# Altium schematic sheet LED_DEMUX.SchDoc
size A4; SheetNumber: 5; SheetTotal: 6
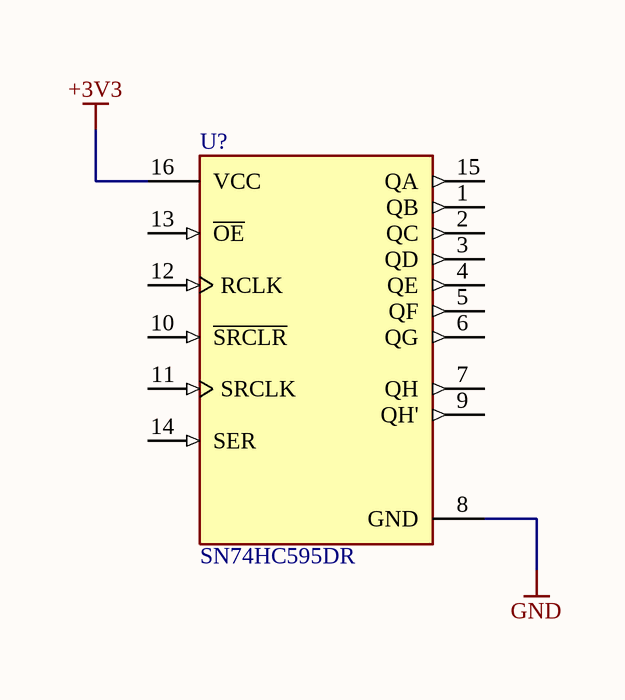
[diagram p0: LED_DEMUX.SchDoc]

## Parts
U?  SN74HC595DR  [FP-D0016A-MFG]

## Nets
+3V3: U?.16(VCC)
GND: U?.8(GND)

Not connected (* = marked no-connect by the designer): U? 1(QB) 2(QC) 3(QD) 4(QE) 5(QF) 6(QG) 7(QH) 9(QH') 10(~{SRCLR}) 11(SRCLK) 12(RCLK) 13(~{OE}) 14(SER) 15(QA)

## Library data of the parts
U? = CMP-0780-00037-4: IC 8BIT SHIFT REG 3ST-OUT 16SOIC; Manufacturer: Texas Instruments; Max Supply Voltage: 6V; Nominal Supply Current: 80uA; Number Of Circuits: 1; Max Junction Temp: +150°C; Propagation Delay: 43ns; Frequency: 29MHz; Description: Shift Shift Register 1 Element 8 Bit 16-SOIC; Min Supply Voltage: 2V; Standoff Height: 0.1mm; Number Of Outputs: 9; Height: 1.75mm; Automotive: No; Device Class L1: Integrated Circuits (ICs); ComponentLink2Description: Datasheet; Ambient Temperature Range Low: -40°C; Ambient Temperature Range High: +85°C; Digikey Description: IC 8BIT SHIFT REG 3ST-OUT 16SOIC; ComponentLink2URL: http://www.ti.com/lit/ds/symlink/sn74hc595.pdf; Package: D0016A; Lead Free: Yes; Manufacturer Part Number: SN74HC595DR; Device Class L3: Shift Registers; Category: IC; Number Of Inputs: 1; Octopart: https://octopart.com/sn74hc595dr-texas+instruments-500634; Ipc Land Pattern Name: SOIC127P600X175-16; Device Class L2: Logic ICs; Temperature Range Low: -40°C; RoHS: TRUE; Temperature: -40°C to +85°C; Temperature Range High: +85°C; Mouser Description: Counter Shift Registers 8bit Shift